# Altium schematic sheet H11R0_Frontend1.SchDoc
size Letter; CompanyName: Hexabitz; DocumentNumber: 3; SheetNumber: 3; SheetTotal: 3
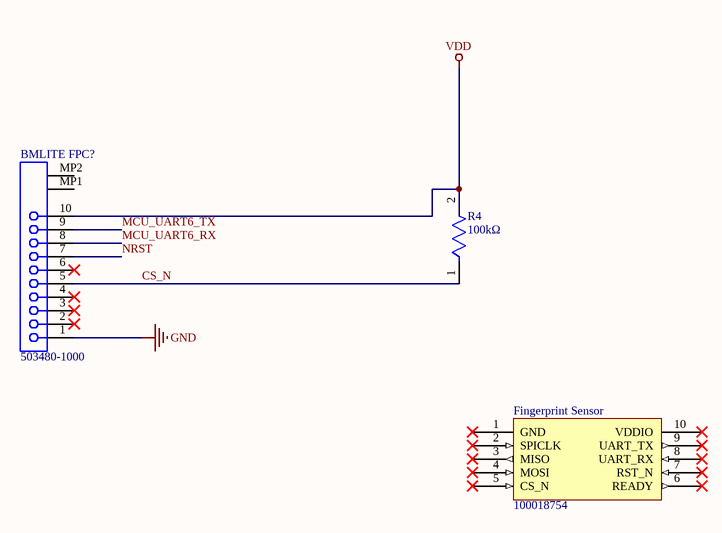
[diagram p0: H11R0_Frontend1.SchDoc]

## Parts
BMLITE_FPC?  503480-1000  [MOLX-503480-1000]
Fingerprint_Sensor  100018754
R4  100kΩ  [FP-RMCF0603-IPC_C]

## Nets
GND: BMLITE_FPC?.1
VDD: BMLITE_FPC?.10 R4.2
CS_N: BMLITE_FPC?.5 R4.1
MCU_UART6_RX: BMLITE_FPC?.8
MCU_UART6_TX: BMLITE_FPC?.9
NRST: BMLITE_FPC?.7

Not connected (* = marked no-connect by the designer): BMLITE_FPC? 2* 3* 4* 6* MP1 MP2; Fingerprint_Sensor 1(GND)* 2(SPICLK)* 3(MISO)* 4(MOSI)* 5(CS_N)* 6(READY)* 7(RST_N)* 8(UART_RX)* 9(UART_TX)* 10(VDDIO)*

## Notes on the sheet
- Module:
- Title:
- Description:
- Size:
- Revision:
- Letter
- www.hexabitz.com
- Date:
- Time:
- Sheet
- of

## Library data of the parts
BMLITE_FPC? = CMP-1241-00115-1: 0.5 mm Pitch Easy-On(TM) BackFlip(TM) Type FPC Connector, 1.0 mm Mated Height, Right Angle, SMT, Dual Contact, 10 Circuits, -40 to 85 degC, ELV and RoHS Compliant, Tape and Reel; Manufacturer: Molex; Durability (mating cycles max): 10; Pitch - Mating Interface: 0.50mm; Material - Plating Mating: Gold; Voltage (Max): 50V AC (RMS)/DC; Polarized to PCB: Yes; PCB Locator: No; Current (Max per Contact): 0.5A; Material - Plating Termination: Gold, Tin; Entry Angle: 90degrees Angle; Mated Height: 1.00mm; Material - Metal: Phosphor Bronze; ComponentLink1Description: Manufacturer URL; PartNumber: 503480-1000; Circuits (Loaded): 10; Packing: Tape and Reel; PackageReference: 503480-1000; ComponentLink2URL: http://www.molex.com/webdocs/datasheets/pdf/en-us/5034801000_FFC_FPC_CONNECTORS.pdf; PackageVersion: Rev. F, 09/2012; ComponentLink3Description: Package Specification; ComponentLink3URL: http://www.molex.com/pdm_docs/sd/5034801000_sd.pdf; PackageDescription: 10-Lead FPC Connector, Pitch 0.5 mm; Stackable: No; Mounting Technology: Surface Mount; ComponentLink2Description: Datasheet; PCB Retention: Yes; Number of Rows: 1; Orientation: Right Angle; Contact Position: Dual; RoHS: TRUE; ComponentLink1URL: http://www.molex.com/molex/index.jsp
Fingerprint_Sensor = CMP-031-00007-1: SENSOR - CAPACITIVE SERIAL SPI
R4 = CMP-26527-007152-1: 100kΩ ±5% 0.1W 0603 Thick Film Chip Resistor AEC-Q200 compliant; Max Power Dissipation: 100mW; Resistance: 100kR; Temperature Coefficient: 200ppm/°C; Max Operating Temperature: 155°C; Width: 0.031inch; Features: Automotive AEC-Q200; Height: 0.022inch; Resistor Type: Thick Film; Case Code (Metric): 1608; Length: 0.061inch; RoHS Compliant: Yes; Number of Terminations: 2; Package Quantity: 1; Case Code (Imperial): 0603; Radiation Hardening: No; Packaging: Tape and Reel; Series: RMCF; Min Operating Temperature: -55°C; Contact Plating: Tin; Mount: Surface Mount; Tolerance: 5%; Case/Package: 0603